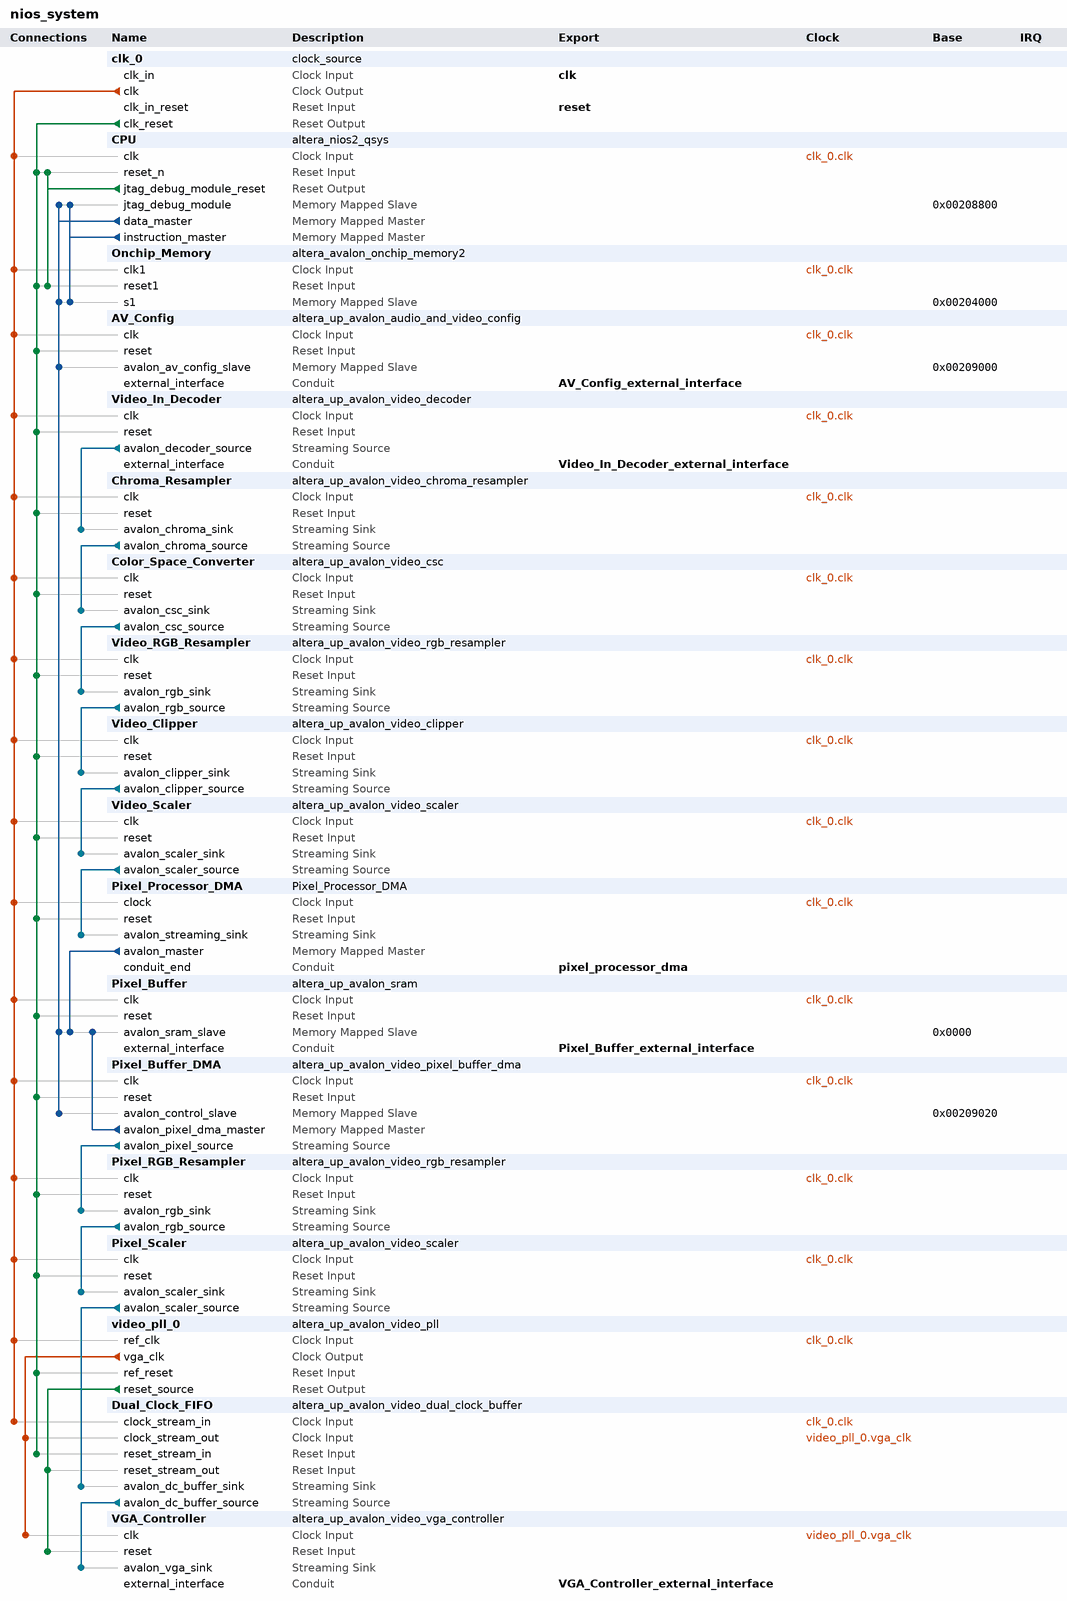
[diagram p0: system contents]
# Platform Designer (Qsys) system nios_system, Cyclone IV E EP4CE115F29C7
# Parameters at their usual value, and those the tool derives, are not listed.
package require -exact qsys 15.0
create_system nios_system
set_project_property DEVICE_FAMILY {Cyclone IV E}
set_project_property DEVICE EP4CE115F29C7

add_instance clk_0 clock_source 15.0
set_instance_parameter_value clk_0 clockFrequency 50000000

add_instance CPU altera_nios2_qsys 15.0
set_instance_parameter_value CPU breakSlave CPU.jtag_debug_module
set_instance_parameter_value CPU exceptionSlave Onchip_Memory.s1
set_instance_parameter_value CPU icache_size 4096
set_instance_parameter_value CPU impl Tiny
set_instance_parameter_value CPU manuallyAssignCpuID false
set_instance_parameter_value CPU resetSlave Onchip_Memory.s1
set_instance_parameter_value CPU resetrequest_enabled true

add_instance Onchip_Memory altera_avalon_onchip_memory2 15.0
set_instance_parameter_value Onchip_Memory dataWidth 32
set_instance_parameter_value Onchip_Memory dualPort false
set_instance_parameter_value Onchip_Memory initMemContent true
set_instance_parameter_value Onchip_Memory initializationFileName Onchip_Memory
set_instance_parameter_value Onchip_Memory memorySize 16384

add_instance AV_Config altera_up_avalon_audio_and_video_config 15.0
set_instance_parameter_value AV_Config audio_in {Microphone to ADC}
set_instance_parameter_value AV_Config bit_length 24
set_instance_parameter_value AV_Config board DE2-115
set_instance_parameter_value AV_Config line_in_bypass false
set_instance_parameter_value AV_Config sampling_rate {48 kHz}

add_instance Video_In_Decoder altera_up_avalon_video_decoder 15.0

add_instance Chroma_Resampler altera_up_avalon_video_chroma_resampler 15.0

add_instance Color_Space_Converter altera_up_avalon_video_csc 15.0

add_instance Video_RGB_Resampler altera_up_avalon_video_rgb_resampler 15.0
set_instance_parameter_value Video_RGB_Resampler alpha 255
set_instance_parameter_value Video_RGB_Resampler input_type {24-bit RGB}
set_instance_parameter_value Video_RGB_Resampler output_type {16-bit RGB}

add_instance Video_Clipper altera_up_avalon_video_clipper 15.0
set_instance_parameter_value Video_Clipper color_bits 16
set_instance_parameter_value Video_Clipper color_planes 1

add_instance Video_Scaler altera_up_avalon_video_scaler 15.0
set_instance_parameter_value Video_Scaler color_bits 16
set_instance_parameter_value Video_Scaler color_planes 1
set_instance_parameter_value Video_Scaler height_scaling 1
set_instance_parameter_value Video_Scaler width_in 640
set_instance_parameter_value Video_Scaler width_scaling 0.5

add_instance Pixel_Processor_DMA Pixel_Processor_DMA 1.0

add_instance Pixel_Buffer altera_up_avalon_sram 15.0
set_instance_parameter_value Pixel_Buffer board DE2-115
set_instance_parameter_value Pixel_Buffer pixel_buffer true

add_instance Pixel_Buffer_DMA altera_up_avalon_video_pixel_buffer_dma 15.0
set_instance_parameter_value Pixel_Buffer_DMA addr_mode X-Y
set_instance_parameter_value Pixel_Buffer_DMA back_start_address 0
set_instance_parameter_value Pixel_Buffer_DMA color_space {16-bit RGB}
set_instance_parameter_value Pixel_Buffer_DMA image_height 240
set_instance_parameter_value Pixel_Buffer_DMA image_width 320
set_instance_parameter_value Pixel_Buffer_DMA start_address 0

add_instance Pixel_RGB_Resampler altera_up_avalon_video_rgb_resampler 15.0
set_instance_parameter_value Pixel_RGB_Resampler alpha 255
set_instance_parameter_value Pixel_RGB_Resampler input_type {16-bit RGB}
set_instance_parameter_value Pixel_RGB_Resampler output_type {30-bit RGB}

add_instance Pixel_Scaler altera_up_avalon_video_scaler 15.0
set_instance_parameter_value Pixel_Scaler color_bits 10
set_instance_parameter_value Pixel_Scaler color_planes 3
set_instance_parameter_value Pixel_Scaler height_scaling 2
set_instance_parameter_value Pixel_Scaler width_in 320
set_instance_parameter_value Pixel_Scaler width_scaling 2

add_instance video_pll_0 altera_up_avalon_video_pll 15.0
set_instance_parameter_value video_pll_0 camera {5MP Digital Camera}
set_instance_parameter_value video_pll_0 gui_refclk 50.0
set_instance_parameter_value video_pll_0 lcd {7" LCD on VEEK-MT and MTL Module}

add_instance Dual_Clock_FIFO altera_up_avalon_video_dual_clock_buffer 15.0
set_instance_parameter_value Dual_Clock_FIFO color_bits 10

add_instance VGA_Controller altera_up_avalon_video_vga_controller 15.0
set_instance_parameter_value VGA_Controller board DE2-115
set_instance_parameter_value VGA_Controller resolution {VGA 640x480}

# connections
add_connection clk_0.clk AV_Config.clk clock
add_connection clk_0.clk Chroma_Resampler.clk clock
add_connection clk_0.clk Color_Space_Converter.clk clock
add_connection clk_0.clk CPU.clk clock
add_connection clk_0.clk Dual_Clock_FIFO.clock_stream_in clock
add_connection clk_0.clk Onchip_Memory.clk1 clock
add_connection clk_0.clk Pixel_Buffer.clk clock
add_connection clk_0.clk Pixel_Buffer_DMA.clk clock
add_connection clk_0.clk Pixel_Processor_DMA.clock clock
add_connection clk_0.clk Pixel_RGB_Resampler.clk clock
add_connection clk_0.clk Pixel_Scaler.clk clock
add_connection clk_0.clk Video_Clipper.clk clock
add_connection clk_0.clk Video_In_Decoder.clk clock
add_connection clk_0.clk video_pll_0.ref_clk clock
add_connection clk_0.clk Video_RGB_Resampler.clk clock
add_connection clk_0.clk Video_Scaler.clk clock
add_connection video_pll_0.vga_clk Dual_Clock_FIFO.clock_stream_out clock
add_connection video_pll_0.vga_clk VGA_Controller.clk clock
add_connection clk_0.clk_reset AV_Config.reset reset
add_connection clk_0.clk_reset Chroma_Resampler.reset reset
add_connection clk_0.clk_reset Color_Space_Converter.reset reset
add_connection clk_0.clk_reset CPU.reset_n reset
add_connection clk_0.clk_reset Dual_Clock_FIFO.reset_stream_in reset
add_connection clk_0.clk_reset Onchip_Memory.reset1 reset
add_connection clk_0.clk_reset Pixel_Buffer.reset reset
add_connection clk_0.clk_reset Pixel_Buffer_DMA.reset reset
add_connection clk_0.clk_reset Pixel_Processor_DMA.reset reset
add_connection clk_0.clk_reset Pixel_RGB_Resampler.reset reset
add_connection clk_0.clk_reset Pixel_Scaler.reset reset
add_connection clk_0.clk_reset Video_Clipper.reset reset
add_connection clk_0.clk_reset Video_In_Decoder.reset reset
add_connection clk_0.clk_reset video_pll_0.ref_reset reset
add_connection clk_0.clk_reset Video_RGB_Resampler.reset reset
add_connection clk_0.clk_reset Video_Scaler.reset reset
add_connection CPU.jtag_debug_module_reset CPU.reset_n reset
add_connection CPU.jtag_debug_module_reset Onchip_Memory.reset1 reset
add_connection video_pll_0.reset_source Dual_Clock_FIFO.reset_stream_out reset
add_connection video_pll_0.reset_source VGA_Controller.reset reset
add_connection CPU.data_master AV_Config.avalon_av_config_slave avalon
set_connection_parameter_value CPU.data_master/AV_Config.avalon_av_config_slave baseAddress 0x00209000
add_connection CPU.data_master CPU.jtag_debug_module avalon
set_connection_parameter_value CPU.data_master/CPU.jtag_debug_module baseAddress 0x00208800
add_connection CPU.data_master Onchip_Memory.s1 avalon
set_connection_parameter_value CPU.data_master/Onchip_Memory.s1 baseAddress 0x00204000
add_connection CPU.data_master Pixel_Buffer.avalon_sram_slave avalon
set_connection_parameter_value CPU.data_master/Pixel_Buffer.avalon_sram_slave baseAddress 0x0000
add_connection CPU.data_master Pixel_Buffer_DMA.avalon_control_slave avalon
set_connection_parameter_value CPU.data_master/Pixel_Buffer_DMA.avalon_control_slave baseAddress 0x00209020
add_connection CPU.instruction_master CPU.jtag_debug_module avalon
set_connection_parameter_value CPU.instruction_master/CPU.jtag_debug_module baseAddress 0x00208800
add_connection CPU.instruction_master Onchip_Memory.s1 avalon
set_connection_parameter_value CPU.instruction_master/Onchip_Memory.s1 baseAddress 0x00204000
add_connection Pixel_Buffer_DMA.avalon_pixel_dma_master Pixel_Buffer.avalon_sram_slave avalon
set_connection_parameter_value Pixel_Buffer_DMA.avalon_pixel_dma_master/Pixel_Buffer.avalon_sram_slave baseAddress 0x0000
add_connection Pixel_Processor_DMA.avalon_master Pixel_Buffer.avalon_sram_slave avalon
set_connection_parameter_value Pixel_Processor_DMA.avalon_master/Pixel_Buffer.avalon_sram_slave baseAddress 0x0000
add_connection Chroma_Resampler.avalon_chroma_source Color_Space_Converter.avalon_csc_sink avalon_streaming
add_connection Color_Space_Converter.avalon_csc_source Video_RGB_Resampler.avalon_rgb_sink avalon_streaming
add_connection Dual_Clock_FIFO.avalon_dc_buffer_source VGA_Controller.avalon_vga_sink avalon_streaming
add_connection Pixel_Buffer_DMA.avalon_pixel_source Pixel_RGB_Resampler.avalon_rgb_sink avalon_streaming
add_connection Pixel_RGB_Resampler.avalon_rgb_source Pixel_Scaler.avalon_scaler_sink avalon_streaming
add_connection Pixel_Scaler.avalon_scaler_source Dual_Clock_FIFO.avalon_dc_buffer_sink avalon_streaming
add_connection Video_Clipper.avalon_clipper_source Video_Scaler.avalon_scaler_sink avalon_streaming
add_connection Video_In_Decoder.avalon_decoder_source Chroma_Resampler.avalon_chroma_sink avalon_streaming
add_connection Video_RGB_Resampler.avalon_rgb_source Video_Clipper.avalon_clipper_sink avalon_streaming
add_connection Video_Scaler.avalon_scaler_source Pixel_Processor_DMA.avalon_streaming_sink avalon_streaming

# exported interfaces
add_interface AV_Config_external_interface conduit end
set_interface_property AV_Config_external_interface EXPORT_OF AV_Config.external_interface
add_interface Pixel_Buffer_external_interface conduit end
set_interface_property Pixel_Buffer_external_interface EXPORT_OF Pixel_Buffer.external_interface
add_interface VGA_Controller_external_interface conduit end
set_interface_property VGA_Controller_external_interface EXPORT_OF VGA_Controller.external_interface
add_interface Video_In_Decoder_external_interface conduit end
set_interface_property Video_In_Decoder_external_interface EXPORT_OF Video_In_Decoder.external_interface
add_interface clk clock sink
set_interface_property clk EXPORT_OF clk_0.clk_in
add_interface pixel_processor_dma conduit end
set_interface_property pixel_processor_dma EXPORT_OF Pixel_Processor_DMA.conduit_end
add_interface reset reset sink
set_interface_property reset EXPORT_OF clk_0.clk_in_reset

set_interconnect_requirement {$system} qsys_mm.clockCrossingAdapter HANDSHAKE
set_interconnect_requirement {$system} qsys_mm.maxAdditionalLatency 0

save_system nios_system.qsys
